# EAGLE schematic Shield-Proteco (EAGLE 9.1.0)
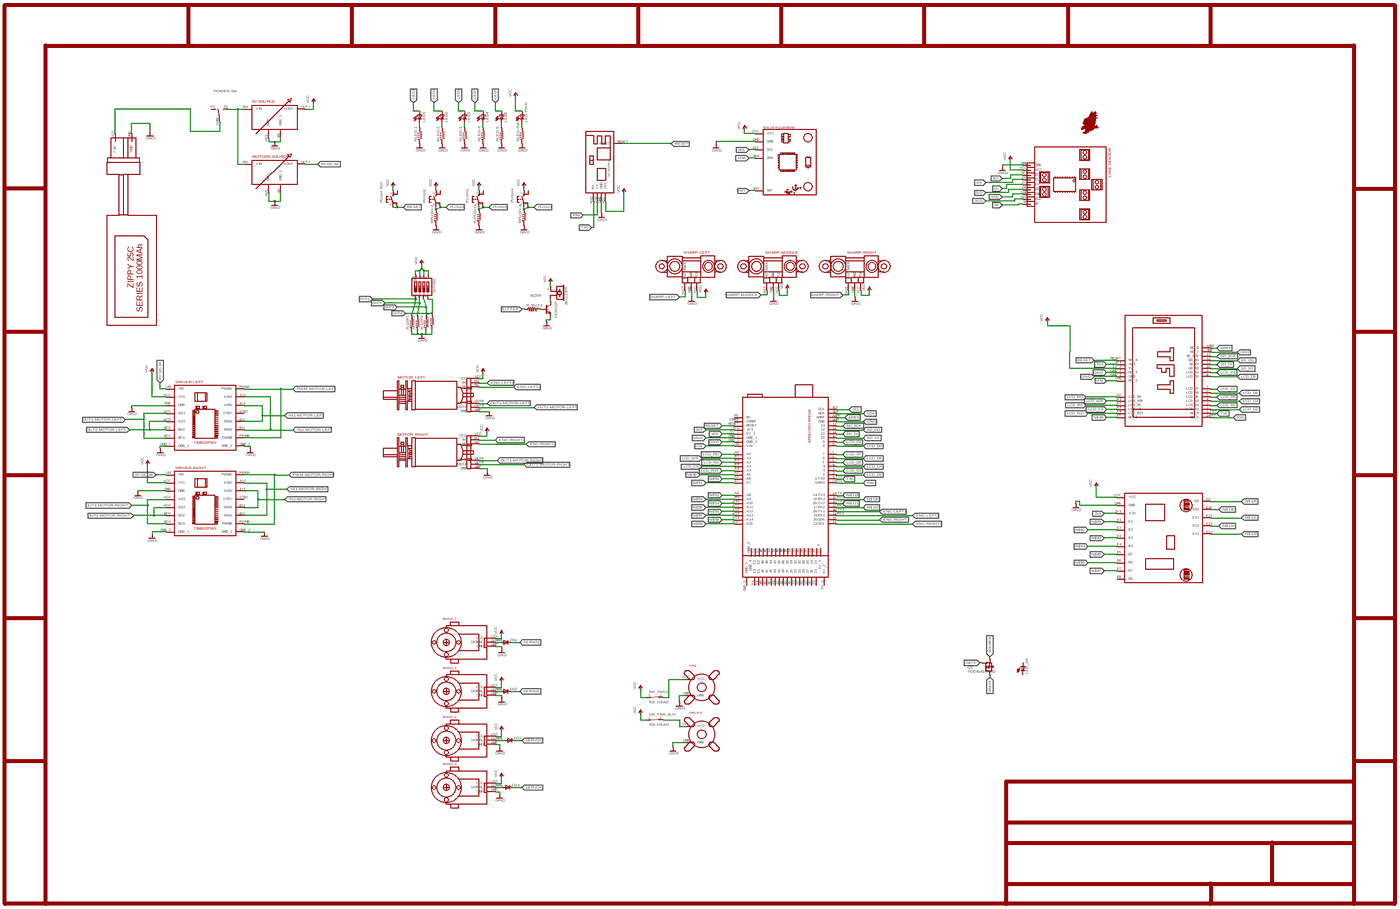
[diagram p0: schematic, sheet 1, overview]
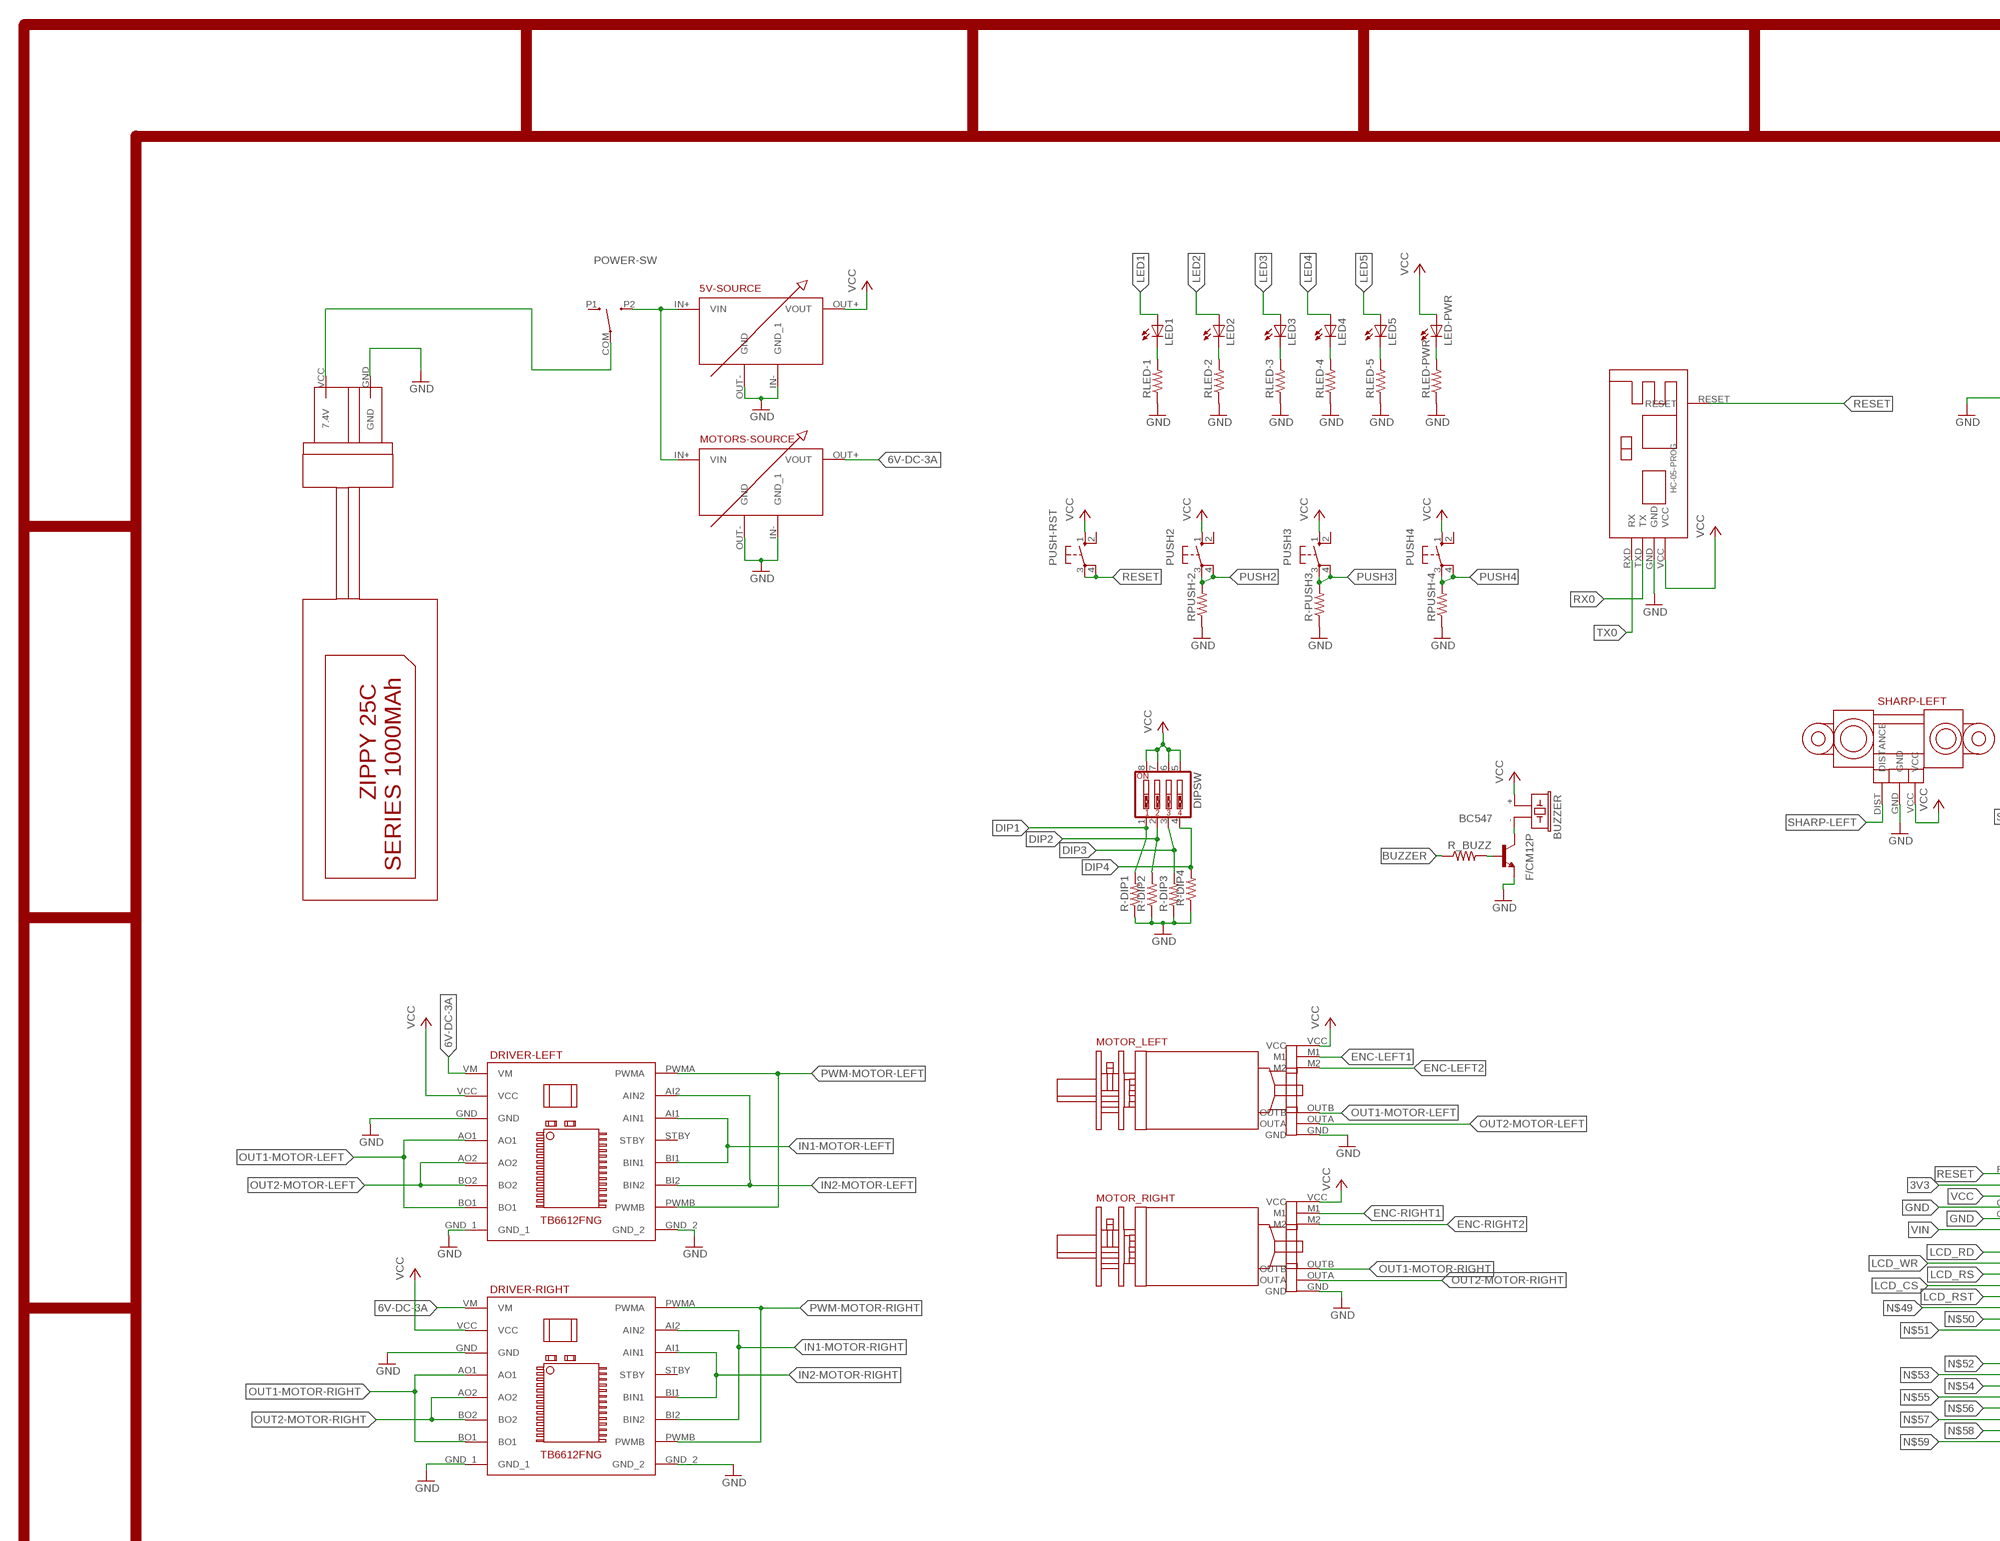
[diagram p1: schematic, sheet 1, part 1 of 4]
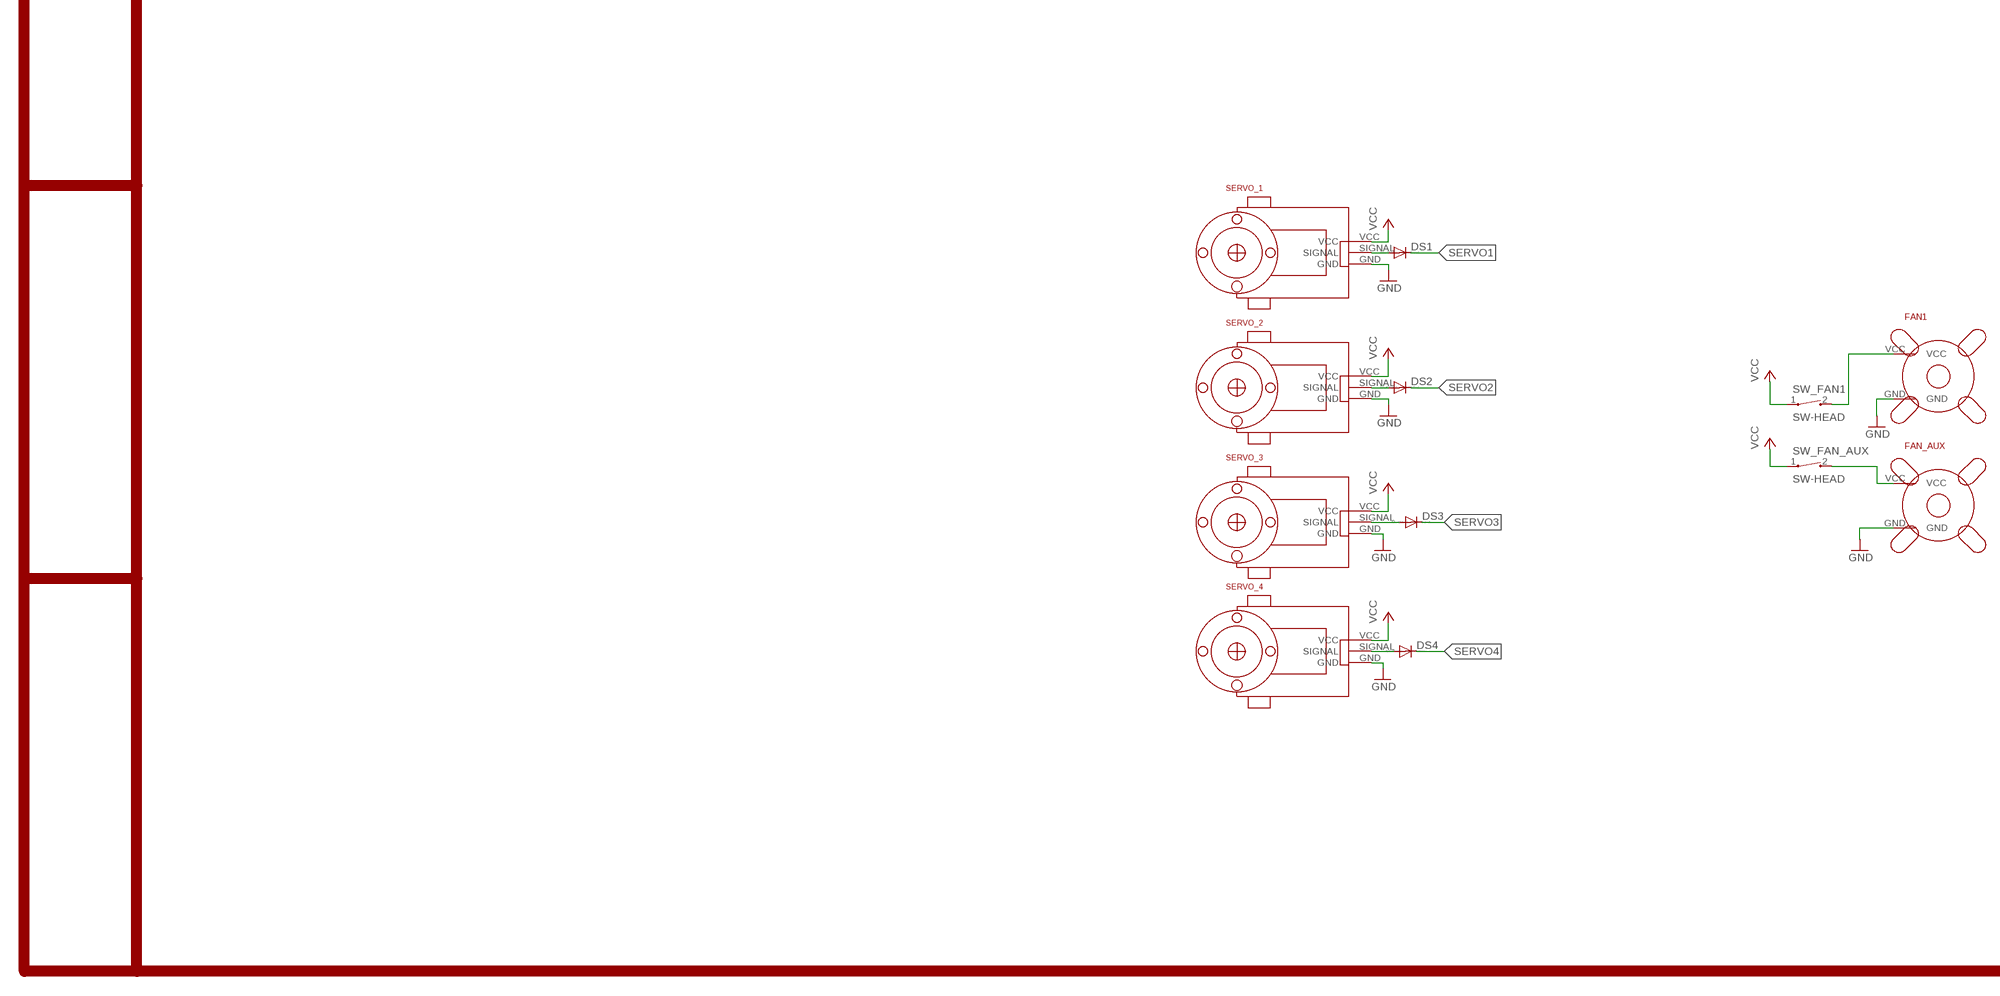
[diagram p2: schematic, sheet 1, part 2 of 4]
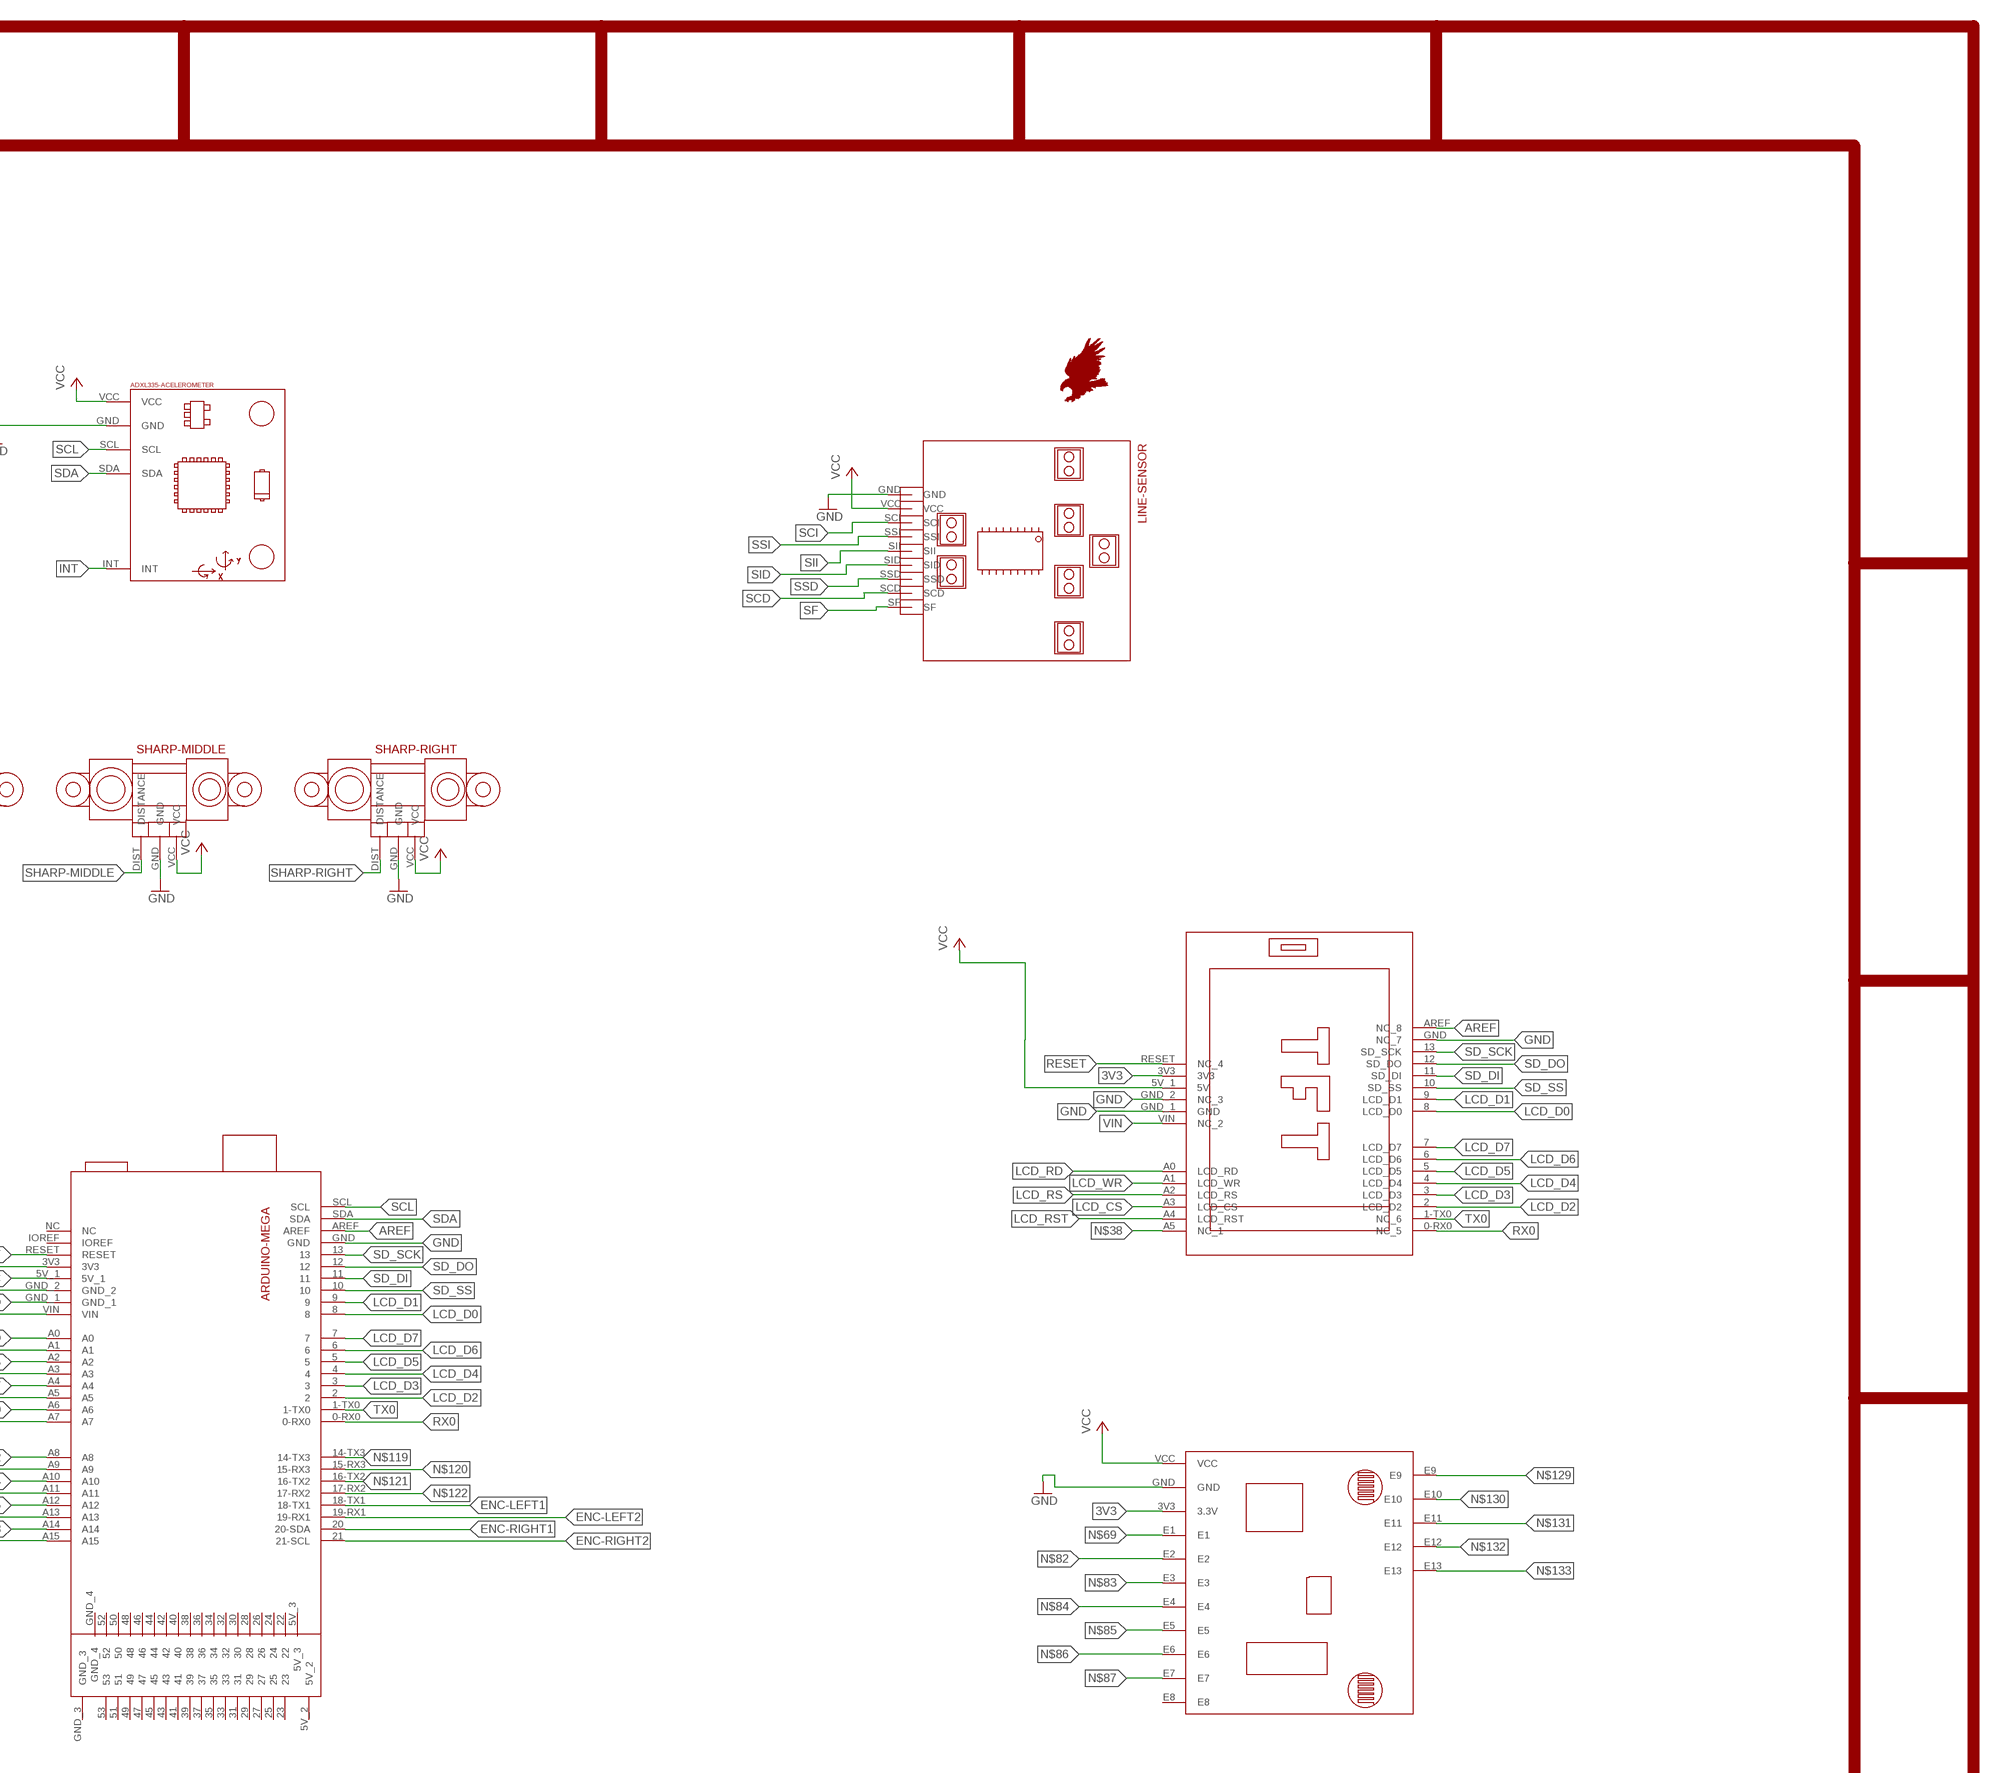
[diagram p3: schematic, sheet 1, part 3 of 4]
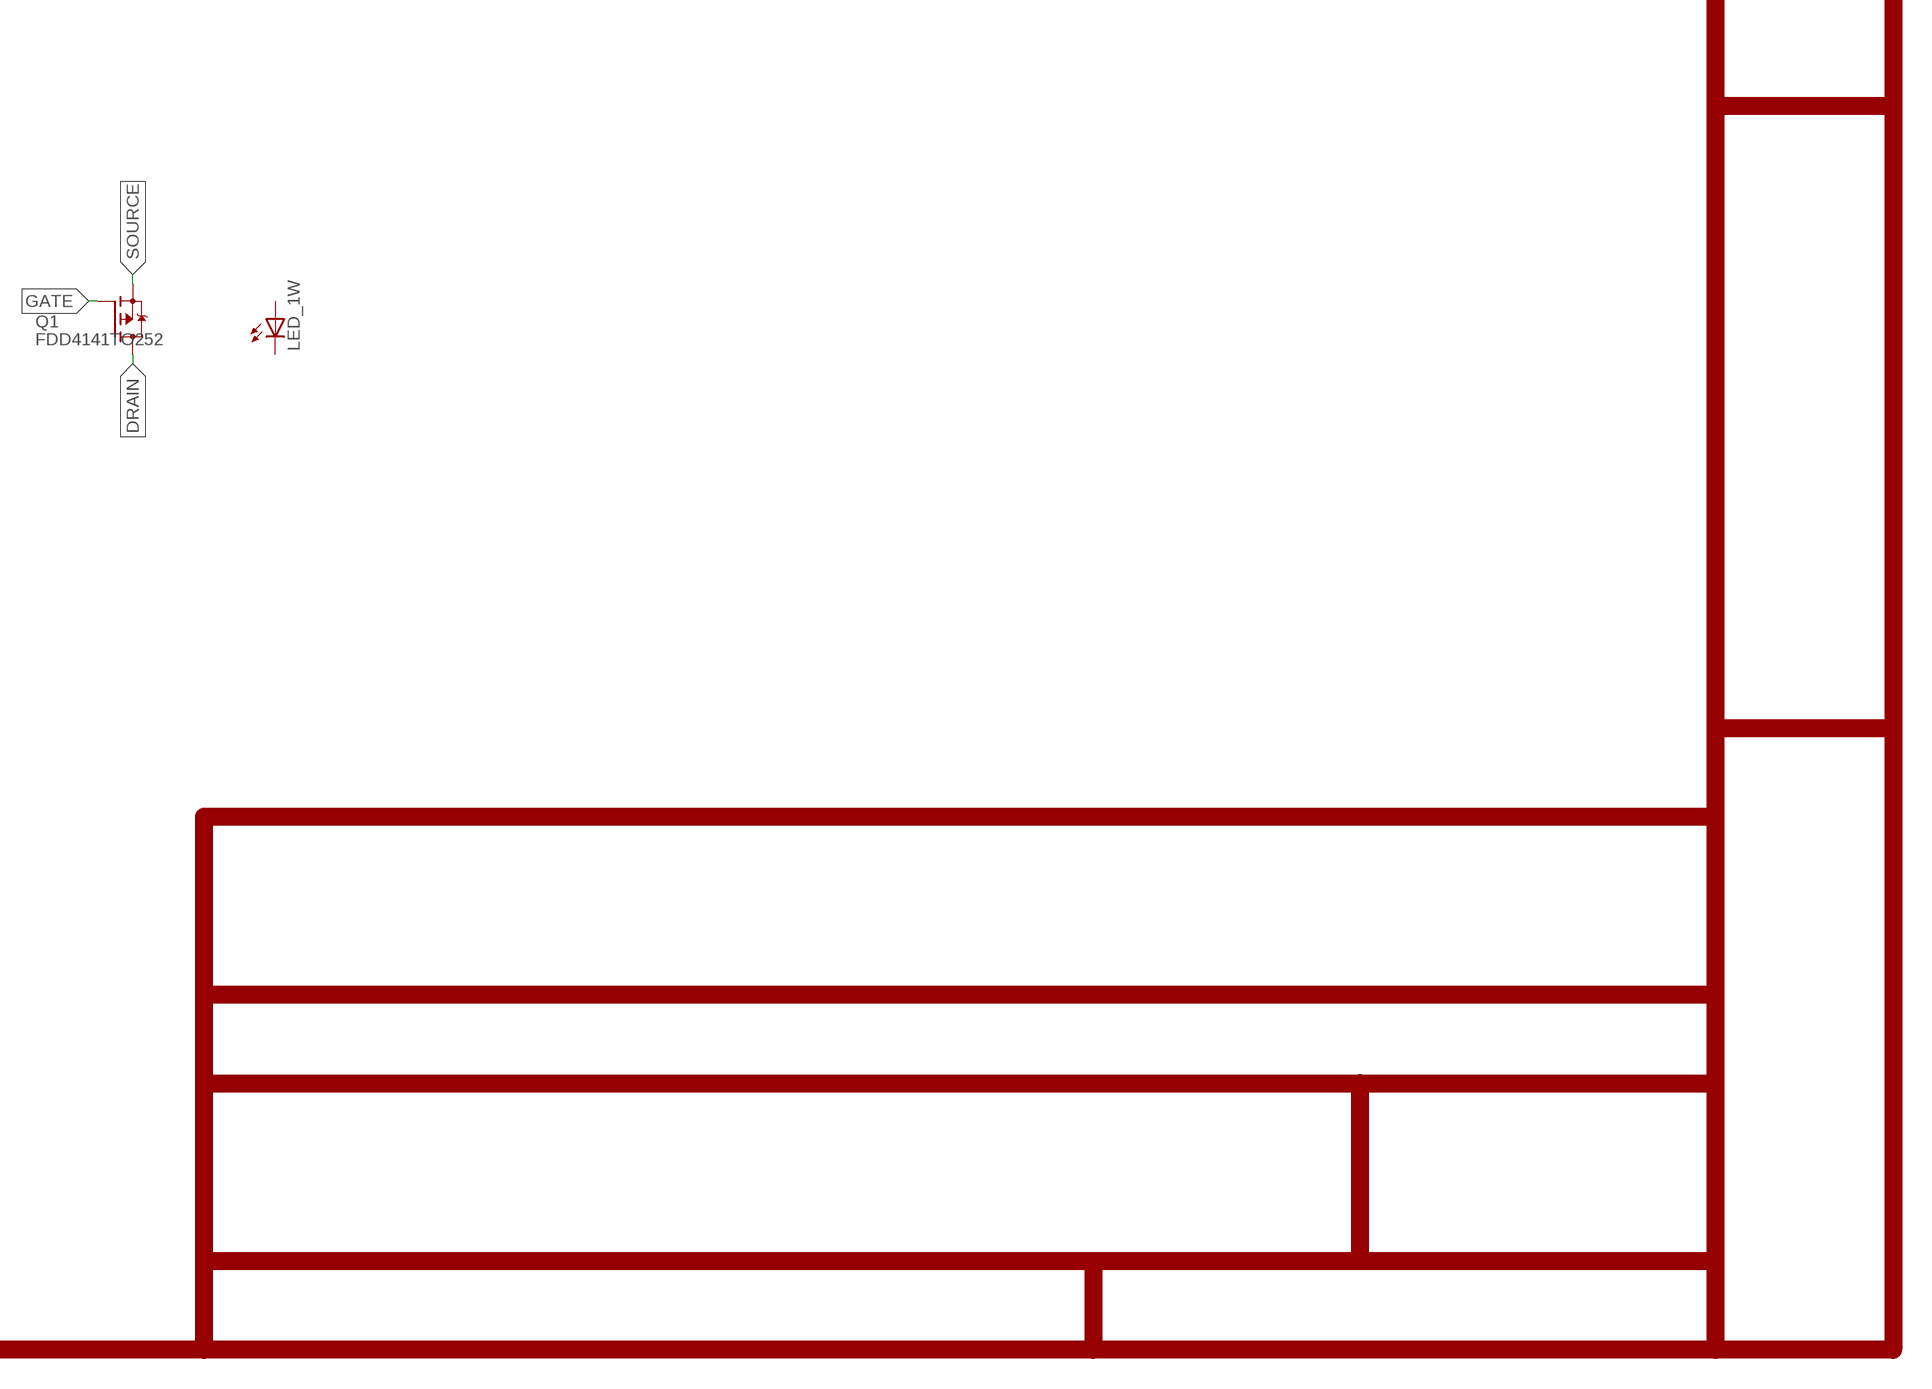
[diagram p4: schematic, sheet 1, part 4 of 4]

## Parts
5V-SOURCE  STEPDOWN-DC-DC  [STEPDOWN-DC-DC]
ADXL335-ACELEROMETER  ACELEROMETER-JST-5  [ACELEROMETER-MPU6050-JST-5]
ARDUINO-MEGA  ARDUINO_MEGA  [ARDUINO-MEGA]
BC547  BC547-NPN-TO92-CBE  [TO92-CBE]
BUZZER  F/CM12P  [F/CM12P]
DIPSW  SW_DIP-4  [EDG-04]
DRIVER-LEFT  TB6612FNG  [TB6612FNG]
DRIVER-RIGHT  TB6612FNG  [TB6612FNG]
DS1  DIODE-DO-214AC  [DO-214AC]
DS2  DIODE-DO-214AC  [DO-214AC]
DS3  DIODE-DO-214AC  [DO-214AC]
DS4  DIODE-DO-214AC  [DO-214AC]
FAN1  FAN-MOLEX  [1X02]
FAN_AUX  FAN-MOLEX  [1X02]
HC-05-PROG  HC-05-PROGRAMER  [HC-05-PROG-COMP]
LED1  LEDCHIPLED_1206  [CHIPLED_1206]
LED2  LEDCHIPLED_1206  [CHIPLED_1206]
LED3  LEDCHIPLED_1206  [CHIPLED_1206]
LED4  LEDCHIPLED_1206  [CHIPLED_1206]
LED5  LEDCHIPLED_1206  [CHIPLED_1206]
LED-PWR  LEDCHIPLED_1206  [CHIPLED_1206]
LED_1W  LED-1W-3V3  [1X02]
LINE-SENSOR  CNY70-ARRAY-HEADER  [CNY70-ARRAY-HEADER]
MOTOR_LEFT  POLOLU-MICROMOTOR  [JST]
MOTOR_RIGHT  POLOLU-MICROMOTOR  [JST]
MOTORS-SOURCE  STEPDOWN-DC-DC  [STEPDOWN-DC-DC]
POWER-SW  SLIDE-3  [SLIDE-3]
PUSH2  10-XX  [B3F-10XX]
PUSH3  10-XX  [B3F-10XX]
PUSH4  10-XX  [B3F-10XX]
PUSH-RST  10-XX  [B3F-10XX]
Q1  FDD4141TO252  [TO252]
R-DIP1  R-US_M1206  [M1206]
R-DIP2  R-US_M1206  [M1206]
R-DIP3  R-US_M1206  [M1206]
R-DIP4  R-US_M1206  [M1206]
R-PUSH3  R-US_M1206  [M1206]
R_BUZZ  R-US_M1206  [M1206]
RLED-1  R-US_M1206  [M1206]
RLED-2  R-US_M1206  [M1206]
RLED-3  R-US_M1206  [M1206]
RLED-4  R-US_M1206  [M1206]
RLED-5  R-US_M1206  [M1206]
RLED-PWR  R-US_M1206  [M1206]
RPUSH-2  R-US_M1206  [M1206]
RPUSH-4  R-US_M1206  [M1206]
SERVO_1  SERVOMOTORES  [SERVO]
SERVO_2  SERVOMOTORES  [SERVO]
SERVO_3  SERVOMOTORES  [SERVO]
SERVO_4  SERVOMOTORES  [SERVO]
SHARP-LEFT  SHARP  [SHARP]
SHARP-MIDDLE  SHARP  [SHARP]
SHARP-RIGHT  SHARP  [SHARP]
SW_FAN1  SW-HEAD  [1X02]
SW_FAN_AUX  SW-HEAD  [1X02]
U$9  SENSOR-MISCELANEOUS  [SENSOR-MISCELANEOUS]
U$14  TFT_ARDUINO-UNO-MEGA  [TFT-ARDUINO-UNO-MEGA]
U$23  ZIIPY-7.4V  [XT60]

## Nets
3V3: ARDUINO-MEGA.3V3 U$9.3V3(3.3V) U$14.3V3
6V-DC-3A: DRIVER-LEFT.VM DRIVER-RIGHT.VM MOTORS-SOURCE.OUT+(VOUT)
AREF: ARDUINO-MEGA.AREF U$14.AREF(NC_8)
BUZZER: R_BUZZ.1
DIP1: DIPSW.1 R-DIP1.2
DIP2: DIPSW.2 R-DIP2.2
DIP3: DIPSW.3 R-DIP3.2
DIP4: DIPSW.4 R-DIP4.2
DRAIN: Q1.3(D)
ENC-LEFT1: ARDUINO-MEGA.18-TX1 MOTOR_LEFT.M1
ENC-LEFT2: ARDUINO-MEGA.19-RX1 MOTOR_LEFT.M2
ENC-RIGHT1: ARDUINO-MEGA.20(20-SDA) MOTOR_RIGHT.M1
ENC-RIGHT2: ARDUINO-MEGA.21(21-SCL) MOTOR_RIGHT.M2
GATE: Q1.1(G)
GND: 5V-SOURCE.IN-(GND_1) 5V-SOURCE.OUT-(GND) ADXL335-ACELEROMETER.GND ARDUINO-MEGA.GND ARDUINO-MEGA.GND_1 ARDUINO-MEGA.GND_2 BC547.E DRIVER-LEFT.GND DRIVER-LEFT.GND_1 DRIVER-LEFT.GND_2 DRIVER-RIGHT.GND DRIVER-RIGHT.GND_1 DRIVER-RIGHT.GND_2 FAN1.GND FAN_AUX.GND HC-05-PROG.GND LINE-SENSOR.GND MOTOR_LEFT.GND MOTOR_RIGHT.GND MOTORS-SOURCE.IN-(GND_1) MOTORS-SOURCE.OUT-(GND) R-DIP1.1 R-DIP2.1 R-DIP3.1 R-DIP4.1 R-PUSH3.1 RLED-1.1 RLED-2.1 RLED-3.1 RLED-4.1 RLED-5.1 RLED-PWR.1 RPUSH-2.1 RPUSH-4.1 SERVO_1.GND SERVO_2.GND SERVO_3.GND SERVO_4.GND SHARP-LEFT.GND SHARP-MIDDLE.GND SHARP-RIGHT.GND U$9.GND U$14.GND(NC_7) U$14.GND_1(GND) U$14.GND_2(NC_3) U$23.GND
IN1-MOTOR-LEFT: DRIVER-LEFT.AI1(AIN1) DRIVER-LEFT.BI1(BIN1)
IN1-MOTOR-RIGHT: DRIVER-RIGHT.AI2(AIN2) DRIVER-RIGHT.BI2(BIN2)
IN2-MOTOR-LEFT: DRIVER-LEFT.AI2(AIN2) DRIVER-LEFT.BI2(BIN2)
IN2-MOTOR-RIGHT: DRIVER-RIGHT.AI1(AIN1) DRIVER-RIGHT.BI1(BIN1)
INT: ADXL335-ACELEROMETER.INT
LCD_CS: ARDUINO-MEGA.A3 U$14.A3(LCD_CS)
LCD_D0: ARDUINO-MEGA.8 U$14.8(LCD_D0)
LCD_D1: ARDUINO-MEGA.9 U$14.9(LCD_D1)
LCD_D2: ARDUINO-MEGA.2 U$14.2(LCD_D2)
LCD_D3: ARDUINO-MEGA.3 U$14.3(LCD_D3)
LCD_D4: ARDUINO-MEGA.4 U$14.4(LCD_D4)
LCD_D5: ARDUINO-MEGA.5 U$14.5(LCD_D5)
LCD_D6: ARDUINO-MEGA.6 U$14.6(LCD_D6)
LCD_D7: ARDUINO-MEGA.7 U$14.7(LCD_D7)
LCD_RD: ARDUINO-MEGA.A0 U$14.A0(LCD_RD)
LCD_RS: ARDUINO-MEGA.A2 U$14.A2(LCD_RS)
LCD_RST: ARDUINO-MEGA.A4 U$14.A4(LCD_RST)
LCD_WR: ARDUINO-MEGA.A1 U$14.A1(LCD_WR)
LED1: LED1.A
LED2: LED2.A
LED3: LED3.A
LED4: LED4.A
LED5: LED5.A
N$5: BC547.C BUZZER.-
N$6: BC547.B R_BUZZ.2
N$14: 5V-SOURCE.IN+(VIN) MOTORS-SOURCE.IN+(VIN) POWER-SW.P2
N$15: FAN_AUX.VCC SW_FAN_AUX.2
N$23: LED1.C RLED-1.2
N$24: LED2.C RLED-2.2
N$25: LED3.C RLED-3.2
N$26: LED4.C RLED-4.2
N$38: U$14.A5(NC_1)
N$49: ARDUINO-MEGA.A5
N$50: ARDUINO-MEGA.A6
N$51: ARDUINO-MEGA.A7
N$52: ARDUINO-MEGA.A8
N$53: ARDUINO-MEGA.A9
N$54: ARDUINO-MEGA.A10
N$55: ARDUINO-MEGA.A11
N$56: ARDUINO-MEGA.A12
N$57: ARDUINO-MEGA.A13
N$58: ARDUINO-MEGA.A14
N$59: ARDUINO-MEGA.A15
N$69: U$9.E1
N$75: DS4.A SERVO_4.SIGNAL
N$76: DS3.A SERVO_3.SIGNAL
N$77: DS2.A SERVO_2.SIGNAL
N$82: U$9.E2
N$83: U$9.E3
N$84: U$9.E4
N$85: U$9.E5
N$86: U$9.E6
N$87: U$9.E7
N$88: LED5.C RLED-5.2
N$89: LED-PWR.C RLED-PWR.2
N$119: ARDUINO-MEGA.14-TX3
N$120: ARDUINO-MEGA.15-RX3
N$121: ARDUINO-MEGA.16-TX2
N$122: ARDUINO-MEGA.17-RX2
N$127: DS1.A SERVO_1.SIGNAL
N$128: FAN1.VCC SW_FAN1.2
N$129: U$9.E9
N$130: U$9.E10
N$131: U$9.E11
N$132: U$9.E12
N$133: U$9.E13
N$134: POWER-SW.COM U$23.VCC(7.4V)
OUT1-MOTOR-LEFT: DRIVER-LEFT.AO1 DRIVER-LEFT.BO1 MOTOR_LEFT.OUTB
OUT1-MOTOR-RIGHT: DRIVER-RIGHT.AO1 DRIVER-RIGHT.BO1 MOTOR_RIGHT.OUTB
OUT2-MOTOR-LEFT: DRIVER-LEFT.AO2 DRIVER-LEFT.BO2 MOTOR_LEFT.OUTA
OUT2-MOTOR-RIGHT: DRIVER-RIGHT.AO2 DRIVER-RIGHT.BO2 MOTOR_RIGHT.OUTA
PUSH2: PUSH2.3(P) PUSH2.4(P1) RPUSH-2.2
PUSH3: PUSH3.3(P) PUSH3.4(P1) R-PUSH3.2
PUSH4: PUSH4.3(P) PUSH4.4(P1) RPUSH-4.2
PWM-MOTOR-LEFT: DRIVER-LEFT.PWMA DRIVER-LEFT.PWMB
PWM-MOTOR-RIGHT: DRIVER-RIGHT.PWMA DRIVER-RIGHT.PWMB
RESET: ARDUINO-MEGA.RESET HC-05-PROG.RESET PUSH-RST.3(P) PUSH-RST.4(P1) U$14.RESET(NC_4)
RX0: ARDUINO-MEGA.0-RX0 HC-05-PROG.TXD(TX) U$14.0-RX0(NC_5)
SCD: LINE-SENSOR.SCD
SCI: LINE-SENSOR.SCI
SCL: ADXL335-ACELEROMETER.SCL ARDUINO-MEGA.SCL
SD_DI: ARDUINO-MEGA.11 U$14.11(SD_DI)
SD_DO: ARDUINO-MEGA.12 U$14.12(SD_DO)
SD_SCK: ARDUINO-MEGA.13 U$14.13(SD_SCK)
SD_SS: ARDUINO-MEGA.10 U$14.10(SD_SS)
SDA: ADXL335-ACELEROMETER.SDA ARDUINO-MEGA.SDA
SERVO1: DS1.C
SERVO2: DS2.C
SERVO3: DS3.C
SERVO4: DS4.C
SF: LINE-SENSOR.SF
SHARP-LEFT: SHARP-LEFT.DIST(DISTANCE)
SHARP-MIDDLE: SHARP-MIDDLE.DIST(DISTANCE)
SHARP-RIGHT: SHARP-RIGHT.DIST(DISTANCE)
SID: LINE-SENSOR.SID
SII: LINE-SENSOR.SII
SOURCE: Q1.2(S)
SSD: LINE-SENSOR.SSD
SSI: LINE-SENSOR.SSI
TX0: ARDUINO-MEGA.1-TX0 HC-05-PROG.RXD(RX) U$14.1-TX0(NC_6)
VCC: 5V-SOURCE.OUT+(VOUT) ADXL335-ACELEROMETER.VCC ARDUINO-MEGA.5V_1 BUZZER.+ DIPSW.5 DIPSW.6 DIPSW.7 DIPSW.8 DRIVER-LEFT.VCC DRIVER-RIGHT.VCC HC-05-PROG.VCC LED-PWR.A LINE-SENSOR.VCC MOTOR_LEFT.VCC MOTOR_RIGHT.VCC PUSH2.1(S) PUSH3.1(S) PUSH4.1(S) PUSH-RST.1(S) SERVO_1.VCC SERVO_2.VCC SERVO_3.VCC SERVO_4.VCC SHARP-LEFT.VCC SHARP-MIDDLE.VCC SHARP-RIGHT.VCC SW_FAN1.1 SW_FAN_AUX.1 U$9.VCC U$14.5V_1(5V)
VIN: ARDUINO-MEGA.VIN U$14.VIN(NC_2)
Unconnected: ARDUINO-MEGA.5V_2 ARDUINO-MEGA.5V_3 ARDUINO-MEGA.22 ARDUINO-MEGA.23 ARDUINO-MEGA.24 ARDUINO-MEGA.25 ARDUINO-MEGA.26 ARDUINO-MEGA.27 ARDUINO-MEGA.28 ARDUINO-MEGA.29 ARDUINO-MEGA.30 ARDUINO-MEGA.31 ARDUINO-MEGA.32 ARDUINO-MEGA.33 ARDUINO-MEGA.34 ARDUINO-MEGA.35 ARDUINO-MEGA.36 ARDUINO-MEGA.37 ARDUINO-MEGA.38 ARDUINO-MEGA.39 ARDUINO-MEGA.40 ARDUINO-MEGA.41 ARDUINO-MEGA.42 ARDUINO-MEGA.43 ARDUINO-MEGA.44 ARDUINO-MEGA.45 ARDUINO-MEGA.46 ARDUINO-MEGA.47 ARDUINO-MEGA.48 ARDUINO-MEGA.49 ARDUINO-MEGA.50 ARDUINO-MEGA.51 ARDUINO-MEGA.52 ARDUINO-MEGA.53 ARDUINO-MEGA.GND_3 ARDUINO-MEGA.GND_4 ARDUINO-MEGA.IOREF ARDUINO-MEGA.NC DRIVER-LEFT.STBY DRIVER-RIGHT.STBY LED_1W.1(A) LED_1W.2(C) POWER-SW.P1 PUSH2.2(S1) PUSH3.2(S1) PUSH4.2(S1) PUSH-RST.2(S1) U$9.E8

## Library data of the parts
5V-SOURCE MOTORS-SOURCE = Reguladores:STEPDOWN-DC-DC: Fuente conmutada tipo stepdown Vin [4.5 a 28V] Vot [0.8 a 20V] Corriente Maxima: 3A Eficiencia de Conversion maxima = 96% frecuencia de conmutacion 15MHz maxima, 1MHz tipica
ADXL335-ACELEROMETER = Sensores:ACELEROMETER-JST-5: Giroscopio de tres ejes y acelerómetro de tres ejes. Fuente de alimentación: 4.3 a 9 V ( regulador de abandono bajo KB33 incorporado ) Modos de comunicación: protocolo de comunicaciones estándar IIC (I2C) Chip incorporado 16 bit ADC convertidor, salida de datos de 16 bits Rango del giroscopio: +/- 250, +/- 500, +/- 1000, +/- 2000 ° / s Rango de aceleración: +/- 2g, +/- 4g, +/- 8g, +/- 16g Dimensiones (excluyendo los pasadores): 21.2 mm (0.84 ") de longitud x 16.4 mm (0.65") de ancho x 3.3 mm (0.13 ") de altura Peso: 2.1g (0.07 oz)
ARDUINO-MEGA = Arduino:ARDUINO_MEGA: El Arduino MEGA 2560 está diseñado para proyectos que requieren más líneas de E / S, más memoria de boceto y más RAM. Con 54 pines de E / S digitales, 16 entradas analógicas y un espacio más grande para su boceto, es la placa recomendada para impresoras 3D y proyectos de robótica. Microcontrolador: ATmega2560 Voltaje Operativo: 5V Voltaje de Entrada: 7-12V Voltaje de Entrada(límites): 6-20V Pines digitales de Entrada/Salida: 54 (de los cuales 15 proveen salida PWM) Pines análogos de entrada: 16 Corriente DC por cada Pin Entrada/Salida: 40 mA Corriente DC entregada en el Pin 3.3V: 50 mA Memoria Flash: 256 KB (8KB usados por el bootloader) SRAM: 8KB EEPROM: 4KB Clock Speed: 16 MHz
BC547 = transistor:*-NPN-: NPN Transistror BF959 corrected 2008.03.06
BUZZER = buzzer:F/CM12P: BUZZER Source: Buerklin; OC_FARNELL: unknown; OC_NEWARK: unknown
DIPSW = special:SW_DIP-4: DIP SWITCH
DRIVER-LEFT DRIVER-RIGHT = Driver-Motor:TB6612FNG: https://www.pololu.com/product/713 Esta pequeña placa es una forma fácil de usar el controlador de motor dual TB6612FNG de Toshiba, que puede controlar de forma independiente dos motores de CC bidireccionales o un motor paso a paso bipolar. Una tensión de motor recomendada de 4.5 V a 13.5 V y una salida de corriente pico de 3 A por canal (1 A continuo) hacen de este un excelente controlador de motor para motores de baja potencia.
DS1-DS4 = diode:DIODE-: DIODE
FAN1 FAN_AUX = Ventilador:FAN-MOLEX
HC-05-PROG = hc-xx:HC-05-PROGRAMER: Con funcion adicional para programar arduino remotamente. HC-05 module is an easy to use Bluetooth SPP (Serial Port Protocol) module, designed for transparent wireless serial connection setup. Serial port Bluetooth module is fully qualified Bluetooth V2.0+EDR (Enhanced Data Rate) 3Mbps Modulation with complete 2.4GHz radio transceiver and baseband. It uses CSR Bluecore 04-External single chip Bluetooth system with CMOS technology and with AFH(Adaptive Frequency Hopping Feature). It has the footprint as small as 12.7mmx27mm. Hope it will simplify your overall design/development cycle.
LED1-LED5 LED-PWR = led:LED: LED OSRAM: - CHIPLED LG R971, LG N971, LY N971, LG Q971, LY Q971, LO R971, LY R971 LH N974, LH R974 LS Q976, LO Q976, LY Q976 LO Q996 - Hyper CHIPLED LW Q18S LB Q993, LB Q99A, LB R99A - SideLED LS A670, LO A670, LY A670, LG A670, LP A670 LB A673, LV A673, LT A673, LW A673 LH A674 LY A675 LS A676, LA A676, LO A676, LY A676, LW A676 LS A679, LY A679, LG A679 - Hyper Micro SIDELED® LS Y876, LA Y876, LO Y876, LY Y876 LT Y87S - SmartLED LW L88C, LW L88S LB L89C, LB L89S, LG L890 LS L89K, LO L89K, LY L89K LS L896, LA L896, LO L896, LY L896 - TOPLED LS T670, LO T670, LY T670, LG T670, LP T670 LSG T670, LSP T670, LSY T670, LOP T670, LYG T670 LG T671, LOG T671, LSG T671 LB T673, LV T673, LT T673, LW T673 LH T674 LS T676, LA T676, LO T676, LY T676, LB T676, LH T676, LSB T676, LW T676 LB T67C, LV T67C, LT T67C, LS T67K, LO T67K, LY T67K, LW E67C LS E67B, LA E67B, LO E67B, LY E67B, LB E67C, LV E67C, LT E67C LW T67C LS T679, LY T679, LG T679 LS T770, LO T770, LY T770, LG T770, LP T770 LB T773, LV T773, LT T773, LW T773 LH T774 LS E675, LA E675, LY E675, LS T675 LS T776, LA T776, LO T776, LY T776, LB T776 LHGB T686 LT T68C, LB T68C - Hyper Mini TOPLED® LB M676 - Mini TOPLED Santana® LG M470 LS M47K, LO M47K, LY M47K Source: http://www.osram.convergy.de LUXEON: - LUMILED® LXK2-PW12-R00, LXK2-PW12-S00, LXK2-PW14-U00, LXK2-PW14-V00 LXK2-PM12-R00, LXK2-PM12-S00, LXK2-PM14-U00 LXK2-PE12-Q00, LXK2-PE12-R00, LXK2-PE12-S00, LXK2-PE14-T00, LXK2-PE14-U00 LXK2-PB12-K00, LXK2-PB12-L00, LXK2-PB12-M00, LXK2-PB14-N00, LXK2-PB14-P00, LXK2-PB14-Q00 LXK2-PR12-L00, LXK2-PR12-M00, LXK2-PR14-Q00, LXK2-PR14-R00 LXK2-PD12-Q00, LXK2-PD12-R00, LXK2-PD12-S00 LXK2-PH12-R00, LXK2-PH12-S00 LXK2-PL12-P00, LXK2-PL12-Q00, LXK2-PL12-R00 Source: www.luxeon.com KINGBRIGHT: KA-3528ASYC Source: www.kingbright.com
LED_1W = LedPower:LED-1W-3V3: led de potencia para complementar camara de raspberry
LINE-SENSOR = Sensores:CNY70-ARRAY-HEADER: Arreglo de sensores reflexivos para seguimiento de linea, señal digital de 1 cm a 1.5 cm. SCI ->Sensor Central Izquierdo ; SSI ->Sensor Superior Izquierdo ; SII ->Sensor Inferior Izquierdo ; SID ->Sensor Inferior Derecho ; SSD ->Sensor Superior Derecho ; SCD ->Sensor Central Derecho ; SF -> Sensor Frontal;
MOTOR_LEFT MOTOR_RIGHT = Motores:POLOLU-MICROMOTOR: Este motorreductor es un motor de CC de 6 V con escobillas de alta potencia en miniatura , con escobillas de carbón de larga duración y una caja de engranajes de metal de 51.45: 1 . Tiene una sección transversal de 10 × 12 mm y el eje de salida de la caja de engranajes en forma de D tiene 9 mm de largo y 3 mm de diámetro 6 V 650 RPM, 100 mA 0.74 kg⋅cm (10 oz⋅in), 1.5 A Agregue codificadores de cuadratura a sus motorreductores de metal, MP o HP (se requiere una versión con eje trasero extendido) con este kit que utiliza un disco magnético y sensores de efecto hall para proporcionar 12 conteos por revolución del eje del motor. Los sensores funcionan de 2.7 V a 18 V y proporcionan salidas digitales que se pueden conectar directamente a un microcontrolador u otro circuito digital. Nota: esta versión no es compatible con los motorreductores de metal micro HPCB; Solo es compatible con motorreductores de metal micro LP, MP y HP de doble eje. https://www.pololu.com/product/2598
POWER-SW = Interruptores:SLIDE-3: Interruptor deslizante de uso fácil
PUSH2-PUSH4 PUSH-RST = switch-omron:10-XX: OMRON SWITCH; MPN: B3F-1000; OC_FARNELL: 176432; OC_NEWARK: 36M3542
Q1 = transistor-fet:FDD4141: P-Channel PowerTrench® MOSFET Source: FDD4141.pdf
R-DIP1-R-DIP4 R-PUSH3 R_BUZZ RLED-1-RLED-5 RLED-PWR RPUSH-2 RPUSH-4 = rcl:R-US_: RESISTOR, American symbol; SPICEPREFIX: R
SERVO_1-SERVO_4 = Motores:SERVOMOTORES: Servomotor normal
SHARP-LEFT SHARP-MIDDLE SHARP-RIGHT = Sensores:SHARP
SW_FAN1 SW_FAN_AUX = Interruptores:SW-HEAD
U$9 = Sensores:SENSOR-MISCELANEOUS: Módulo con sensores que se agregaran mas tarde si son necesarios
U$14 = TFT:TFT_ARDUINO-UNO-MEGA: Pantalla LCD TFT de 2,4” Chip controlador LCD ILI9341 (Enlace para descargar el Datasheet ILI9341) 320×240 pixeles de resolución y 262.000 colores Panel táctil resistivo de 4 hilos Compatible con tensión de 5V ya que dispone de regulador de tensión en placa Conexión Shield para Arduino UNO Tamaño: 71 x 52 x 7 mm (L x A x H)
U$23 = Baterias:ZIIPY-7.4V: BATERIA POLIMERO DE LITIO 7.4V